# EAGLE design USB_mini_04 (EAGLE 4.91)
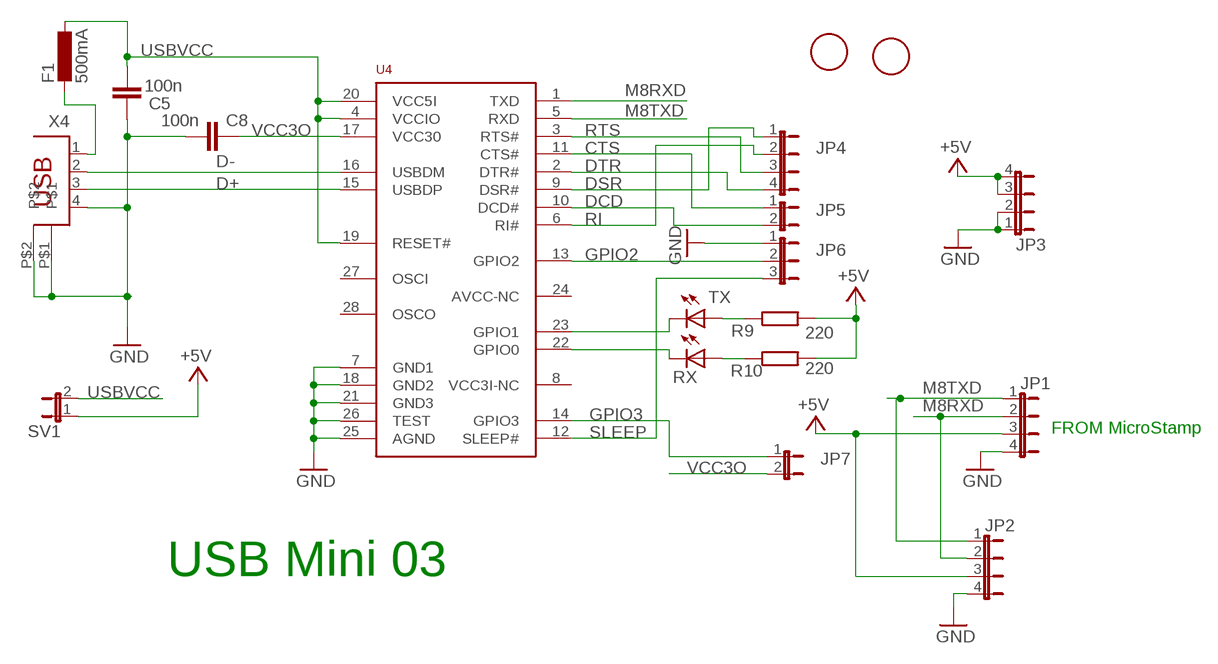
[diagram p0: schematic, sheet 1]

## Parts
C5  100n  C-EU  [0805RND]
C8  100n  C-EU  [0805RND]
F1  500mA  L-EUL1812  [L1812]
JP1  JP4E  [JP4]
JP2  JP4E  [JP4]
JP3  JP4E  [JP4]
JP4  JP4E  [JP4]
JP5  JP1E  [JP1]
JP6  JP2E  [JP2]
JP7  JP1E  [JP1]
R9  220  R-EU_  [0805RND]
R10  220  R-EU_  [0805RND]
RX  LED0805ROUND  [0805RND]
SV1  JP1E  [JP1]
TX  LED0805ROUND  [0805RND]
U4  FT232RL  [SSOP28]
U$1  FIDUCIALMOUNT  [FIDUCIA-MOUNT]
U$2  FIDUCIALMOUNT  [FIDUCIA-MOUNT]
X4  PN61729  [PN61729]

## Nets
+5V [power]: JP1.3 JP2.3 JP3.3 JP3.4 R9.P$2 R10.P$2 SV1.1
CTS: JP5.1 U4.11(CTS#)
D+: U4.15(USBDP) X4.3
D-: U4.16(USBDM) X4.2
DCD: JP5.2 U4.10(DCD#)
DSR: JP4.1 U4.9(DSR#)
DTR: JP4.4 U4.2(DTR#)
GND [usbvcc]: C5.P$2 C8.P$1 JP1.4 JP2.4 JP3.1 JP3.2 JP6.1 U4.7(GND1) U4.18(GND2) U4.21(GND3) U4.25(AGND) U4.26(TEST) X4.4 X4.P$1 X4.P$2
GPIO2: JP6.2 U4.13(GPIO2)
GPIO3: JP7.1 U4.14(GPIO3)
M8RXD: JP1.2 JP2.2 U4.1(TXD)
M8TXD: JP1.1 JP2.1 U4.5(RXD)
N$2 [usbvcc]: F1.2 X4.1
N$32: TX.P$2(C) U4.23(GPIO1)
N$34: RX.P$2(C) U4.22(GPIO0)
N$35: R9.P$1 TX.P$1(A)
N$36: R10.P$1 RX.P$1(A)
RI: JP4.2 U4.6(RI#)
RTS: JP4.3 U4.3(RTS#)
SLEEP: JP6.3 U4.12(SLEEP#)
USBVCC [usbvcc]: C5.P$1 F1.1 SV1.2 U4.4(VCCIO) U4.19(RESET#) U4.20(VCC5I)
VCC3O: C8.P$2 JP7.2 U4.17(VCC30)
Unconnected: U4.8(VCC3I-NC) U4.24(AVCC-NC) U4.27(OSCI) U4.28(OSCO)

## Notes on the sheet
- FROM MicroStamp
- USB Mini 03

## Library data of the parts
C5 C8 = rcl:C-EU: CAPACITOR, European symbol
F1 = rcl:L-EU: INDUCTOR, European symbol
JP1-JP4 = jumper:JP4E: JUMPER
JP5 JP7 SV1 = jumper:JP1E: JUMPER
JP6 = jumper:JP2E: JUMPER
R9 R10 = rcl:R-EU_: RESISTOR, European symbol
RX TX = led:LED: LED OSRAM: - CHIPLED LG R971, LG N971, LY N971, LG Q971, LY Q971, LO R971, LY R971 LH N974, LH R974 LS Q976, LO Q976, LY Q976 LO Q996 - Hyper CHIPLED LW Q18S LB Q993, LB Q99A, LB R99A - SideLED LS A670, LO A670, LY A670, LG A670, LP A670 LB A673, LV A673, LT A673, LW A673 LH A674 LY A675 LS A676, LA A676, LO A676, LY A676, LW A676 LS A679, LY A679, LG A679 - Hyper Micro SIDELED® LS Y876, LA Y876, LO Y876, LY Y876 LT Y87S - SmartLED LW L88C, LW L88S LB L89C, LB L89S, LG L890 LS L89K, LO L89K, LY L89K LS L896, LA L896, LO L896, LY L896 - TOPLED LS T670, LO T670, LY T670, LG T670, LP T670 LSG T670, LSP T670, LSY T670, LOP T670, LYG T670 LG T671, LOG T671, LSG T671 LB T673, LV T673, LT T673, LW T673 LH T674 LS T676, LA T676, LO T676, LY T676, LB T676, LH T676, LSB T676, LW T676 LB T67C, LV T67C, LT T67C, LS T67K, LO T67K, LY T67K, LW E67C LS E67B, LA E67B, LO E67B, LY E67B, LB E67C, LV E67C, LT E67C LW T67C LS T679, LY T679, LG T679 LS T770, LO T770, LY T770, LG T770, LP T770 LB T773, LV T773, LT T773, LW T773 LH T774 LS E675, LA E675, LY E675, LS T675 LS T776, LA T776, LO T776, LY T776, LB T776 LHGB T686 LT T68C, LB T68C - Hyper Mini TOPLED® LB M676 - Mini TOPLED Santana® LG M470 LS M47K, LO M47K, LY M47K Source: http://www.osram.convergy.de/
U4 = SmartPrj:FT232RL
U$1 U$2 = SmartPrj:FIDUCIALMOUNT
X4 = SmartPrj:PN61729: BERG USB connector

## Net classes
0 default: width 0.254 mm, clearance 0.254 mm
1 power: width 0.61 mm, clearance 0.254 mm
3 usbvcc: width 0.356 mm, clearance 0.254 mm

## Board
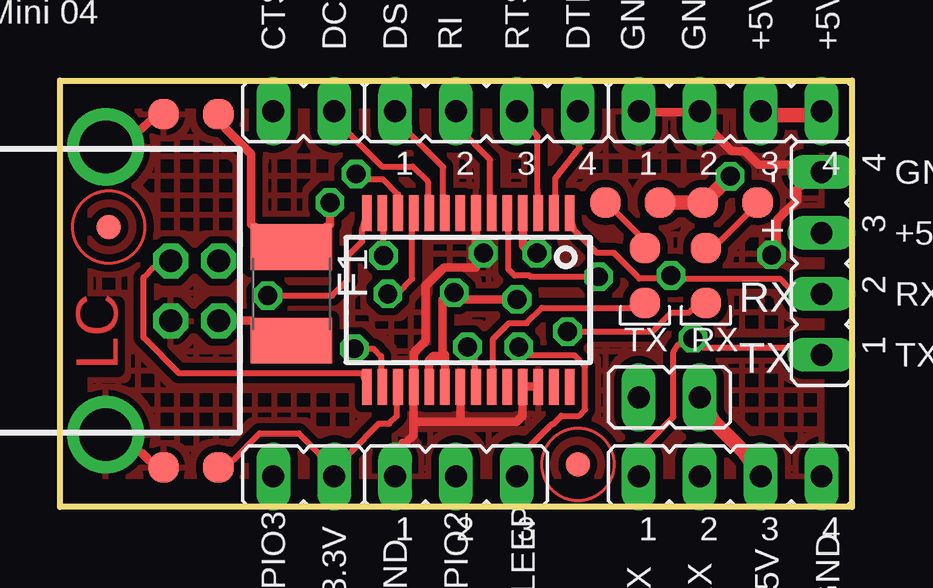
[diagram p1: board, top side]
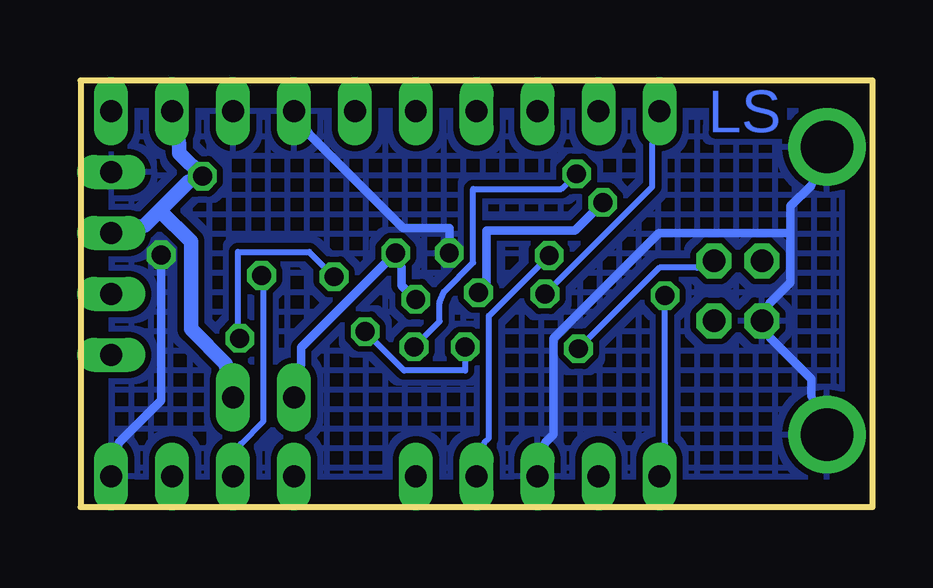
[diagram p2: board, bottom side, seen from below]

Size 33.02 x 17.78 mm. Coordinates in mm from the lower left corner, seen from the top.
Outline: 0,0 0,17.78 33.02,17.78 33.02,0 0,0
Copper layers (1*16): Top 0.035mm / dielectric 1.5mm / Bottom 0.035mm
Design rules "default": minimum track width 10mil, minimum drill 31mil, track to track 10mil, track to pad 10mil, pad to pad 10mil, via to via 16mil, smd to smd 10mil, copper to edge 40mil, drill to drill 10mil, minimum pad ring 10mil, minimum via ring 8mil, stop-mask expansion 4mil, vias tented up to drill 0mil, thermal gap 10mil

### Footprints (pad centres in the part's own frame; a part is rotated, then mirrored left to right if it is on the bottom)
0805RND = smd 1.27 x 1.27: P$1 -1.143,0; P$2 1.143,0
L1812 = smd 1.9 x 3.4: 1 -1.95,0; 2 1.95,0
JP4 = drill 0.914 long: 1 -3.81,0; 2 -1.27,0; 3 1.27,0; 4 3.81,0
JP1 = drill 0.914 long: 1 0,-1.27; 2 0,1.27
JP2 = drill 0.914 long: 1 -2.54,0; 2 0,0; 3 2.54,0
SSOP28 = smd 0.4 x 1.5: 1 -4.225,-3.625; 2 -3.575,-3.625; 3 -2.925,-3.625; 4 -2.275,-3.625; 5 -1.625,-3.625; 6 -0.975,-3.625; 7 -0.325,-3.625; 8 0.325,-3.625; 9 0.975,-3.625; 10 1.625,-3.625; 11 2.275,-3.625; 12 2.925,-3.625; 13 3.575,-3.625; 14 4.225,-3.625; 15 4.225,3.625; 16 3.575,3.625; 17 2.925,3.625; 18 2.275,3.625; 19 1.625,3.625; 20 0.975,3.625; 21 0.325,3.625; 22 -0.325,3.625; 23 -0.975,3.625; 24 -1.625,3.625; 25 -2.275,3.625; 26 -2.925,3.625; 27 -3.575,3.625; 28 -4.225,3.625
FIDUCIA-MOUNT = smd 1.016 x 1.016: P$1 0,0
PN61729 = drill 0.95 octagon: 1 1.25,4.71; 2 -1.25,4.71; 3 -1.25,2.71; 4 1.25,2.71 | drill 2.2 round: P$1 -6,0; P$2 6,0

### Placement (x,y rotation side)
C5  5.46,16.38 180 top
C8  5.46,1.65 0 top
F1  9.65,8.89 270 top
JP1  31.75,10.16 90 top
JP2  27.94,1.27 0 top
JP3  27.94,16.51 0 top
JP4  17.78,16.51 0 top
JP5  10.16,16.51 270 top
JP6  16.51,1.27 0 top
JP7  10.16,1.27 270 top
R9  23.88,12.7 0 top
R10  27.94,12.7 180 top
RX  26.92,9.65 270 top
SV1  25.4,4.57 90 top
TX  24.38,9.65 270 top
U4  17.02,8.64 180 top
U$1  2.03,11.68 0 top
U$2  21.59,1.78 0 top
X4  1.91,9.02 270 top

### Tracks (layer width: path | path; a pad name or v marks a point on that pad's centre or on a via)
+5V  (via drill 0.79)
  Top 0.61: JP2.3 28.52,2.29 27.3,3.5 SV1.1 | R9.P$2 R10.P$2 27.28,13.13 v27.94,13.79 | JP3.4 31.06,16.33 29.9,16.33 JP3.3
  Bottom 0.61: JP3.3 28.91,15.11 28.91,14.76 v27.94,13.79 28.52,13.56 29.72,12.37 | 29.72,12.37 30.35,11.73 JP1.3 | SV1.1 26.98,5.97 28.42,7.42 28.42,11.07 29.72,12.37
CTS  (via drill 0.79)
  Top 0.254: v13.66,8.89 14.05,8.89 14.68,9.53 14.68,11.53 U4.11
  Bottom 0.254: v13.66,8.89 9.2,13.36 9.2,15.11 JP5.1
D+
  Top 0.254: U4.15 12.6,5.59 4.95,5.59 3.48,7.06 3.48,9.58 3.89,9.98 X4.3
D-  (via drill 0.79)
  Top 0.254: v12.27,6.6 13.07,6.6 13.39,6.29 13.39,5.74 U4.16
  Bottom 0.254: v12.27,6.6 8.89,9.98 7.34,9.98 X4.2
DCD
  Top 0.254: U4.10 15.34,13.01 15.34,13.56 14.71,14.2 13.44,14.2 12.14,15.49 12.12,15.49 JP5.2
DSR
  Top 0.254: U4.9 15.98,13.01 15.98,14.17 15.37,14.78 14.66,15.49 JP4.1
DTR
  Top 0.254: U4.2 20.65,13.01 20.65,13.72 21.67,14.99 JP4.4
GND  (via drill 0.79)
  Top 0.356: JP3.1 24.82,16.46 25.98,16.46 JP3.2 27.36,15.49 28.02,14.83 28.55,14.83 29.11,14.28 30.35,14.28 JP1.4 30.73,13.28 30.73,12.8 29.9,11.96 29.9,10.74 v29.67,10.52 | U4.26 19.76,5.03 19.48,5.03 U4.25 19.28,4.27 19.28,3.81 19.02,3.56 16.69,3.56 | 14.73,3.56 14.73,4.27 U4.18 14.76,5.74 14.76,6.45 15.24,6.93 15.24,9.22 16,9.98 17.35,9.98 17.35,10.59 | 14.73,3.56 14.73,2.98 14.41,2.67 14.28,2.67 JP6.1 | 16.69,3.56 16.69,4.27 U4.21 | 14.73,3.56 16.69,3.56 | 17.35,10.59 17.35,11.53 U4.7 | C5.P$2 3.71,16.08 3.4,15.77 X4.P$1 | C8.P$1 3.71,1.96 3.4,2.26 X4.P$2 | 17.35,10.59 v17.65,10.59
  Bottom 0.356: v29.67,10.52 29.67,4.45 31.45,2.67 JP2.4 | X4.P$2 2.56,4.62 2.56,5.33 4.29,7.06 X4.4 4.32,8.48 3.43,9.37 3.43,11.43 | 3.43,11.43 3.43,12.55 2.56,13.41 X4.P$1 | JP6.1 13.66,2.67 13.31,3.02 13.31,7.04 8.91,11.43 3.43,11.43 | v17.65,10.59 17.65,11.63 19.58,11.63 23.44,15.49 JP3.1
  pour Top (isolate 0.305, hatched): 0.5,0.5 32.5,0.5 32.5,17.5 0.5,17.5
  pour Bottom (hatched): 0.5,0.5 0.5,17.5 32.5,17.5 32.5,0.5
GPIO2  (via drill 0.79)
  Top 0.254: v13.49,10.49 13.49,11.53 U4.13
  Bottom 0.254: v13.49,10.49 16,7.98 16,2.87 16.2,2.67 JP6.2
GPIO3  (via drill 0.79)
  Top 0.254: v8.66,8.81 11.35,8.81 11.99,9.45 11.99,10.46 12.6,11.07 12.6,11.53 U4.14
  Bottom 0.254: v8.66,8.81 8.66,2.67 JP7.1
M8RXD  (via drill 0.79)
  Top 0.254: 25.48,9.53 30.02,9.53 30.35,9.2 JP1.2 | 25.48,9.53 24.16,9.53 23.09,10.59 22.38,10.59 21.44,11.53 U4.1 | v25.48,9.65 25.48,9.53
  Bottom 0.254: v25.48,9.65 25.4,9.58 25.4,3.58 26.34,2.64 JP2.2
M8TXD  (via drill 0.79)
  Top 0.254: v22.45,9.6 19.63,9.6 19.58,9.65 18.95,9.65 18.69,9.91 18.69,11.53 U4.5 | JP1.1 30.35,6.66 26.77,6.66 v26.39,7.04 25.77,6.76 25.58,6.47 25.58,3.76 24.46,2.64 JP2.1
  Bottom 0.254: v22.45,9.6 23.5,10.64 26.47,10.64 26.47,7.11 v26.39,7.04
N$2
  Top 0.356: X4.1 7.34,7.77 7.98,7.77 F1.2
N$32
  Top 0.254: TX.P$2 23.77,8.31 20.09,8.31 19.46,7.67 18.72,7.67 18.06,7.01 18.06,5.74 U4.23
N$34  (via drill 0.79)
  Top 0.254: v21.16,7.32 24.69,7.32 25.48,8.1 26.21,8.1 26.31,8.2 RX.P$2 | v16.99,6.68 17.3,6.38 17.3,5.74 U4.22
  Bottom 0.254: v21.16,7.32 19.53,5.69 16.99,5.69 v16.99,6.68
N$35
  Top 0.254: R9.P$1 23.22,12.27 24.08,11.4 TX.P$1
N$36
  Top 0.254: RX.P$1 27.53,11.1 28.65,12.22 R10.P$1
RI
  Top 0.254: U4.6 17.93,13.01 17.93,14.48 17.3,15.11 16.56,15.88 JP4.2
RTS
  Top 0.254: U4.3 19.89,13.01 19.92,13.05 19.91,13.21 19.91,15.44 JP4.3
SLEEP  (via drill 0.79)
  Top 0.254: v12.34,13.89 12.57,13.66 13.46,13.66 14.1,13.03 14.1,13.01 U4.12 | v19.13,6.68 19.48,6.33 21.44,6.33 21.89,5.87 21.89,4.06 21.64,3.81 20.9,3.81 20.55,3.45 20.5,3.45 19.53,2.49 JP6.3
  Bottom 0.254: v12.34,13.89 12.98,13.26 16.66,13.26 16.66,10.19 17.87,8.97 18.06,8.53 18.06,7.75 v19.13,6.68
USBVCC  (via drill 0.79)
  Top 0.356: C5.P$1 6.91,15.77 7.98,14.71 7.98,11.79 F1.1 11.25,11.79 v11.25,12.7 | U4.19 15.39,5.99 15.39,6.12 15.57,6.3 15.85,6.3 16.05,6.1 16.05,5.99 U4.20 16.05,6.35 15.95,6.45 15.95,7.42 15.95,8.66 16.43,8.66 | v19.89,10.59 19.62,10.59 19.3,10.91 19.3,11.53 U4.4 | 16.43,8.66 v19.05,8.66 | v16.43,8.94 16.43,8.66
  Bottom 0.356: SV1.2 23.82,5.97 23.82,6.66 v19.89,10.59 19.63,10.01 19.63,9.25 v19.05,8.66 | v11.25,12.7 12.42,11.53 16.1,11.53 16.1,9.27 v16.43,8.94
VCC3O
  Top 0.254: C8.P$2 7.21,1.96 8.33,3.07 9.96,3.07 10.74,2.29 JP7.2 12.12,2.29 13.31,3.48 13.73,3.48 14.05,3.8 14.05,4.27 U4.17

### Text on the board
Top: LC
Bottom: LS
tPlace: Made in Italy | USB Mini 04 | CTS | DCD | DSR | RI | RTS | DTR | GND | GND | +5V | +5V | - | GND | + | +5V | RX | RX | TX | TX | TX | RX | +5V | GND | GPIO3 | +3.3V | GND | GPIO2 | SLEEP